# Altium schematic sheet Sheet1.SchDoc
size C
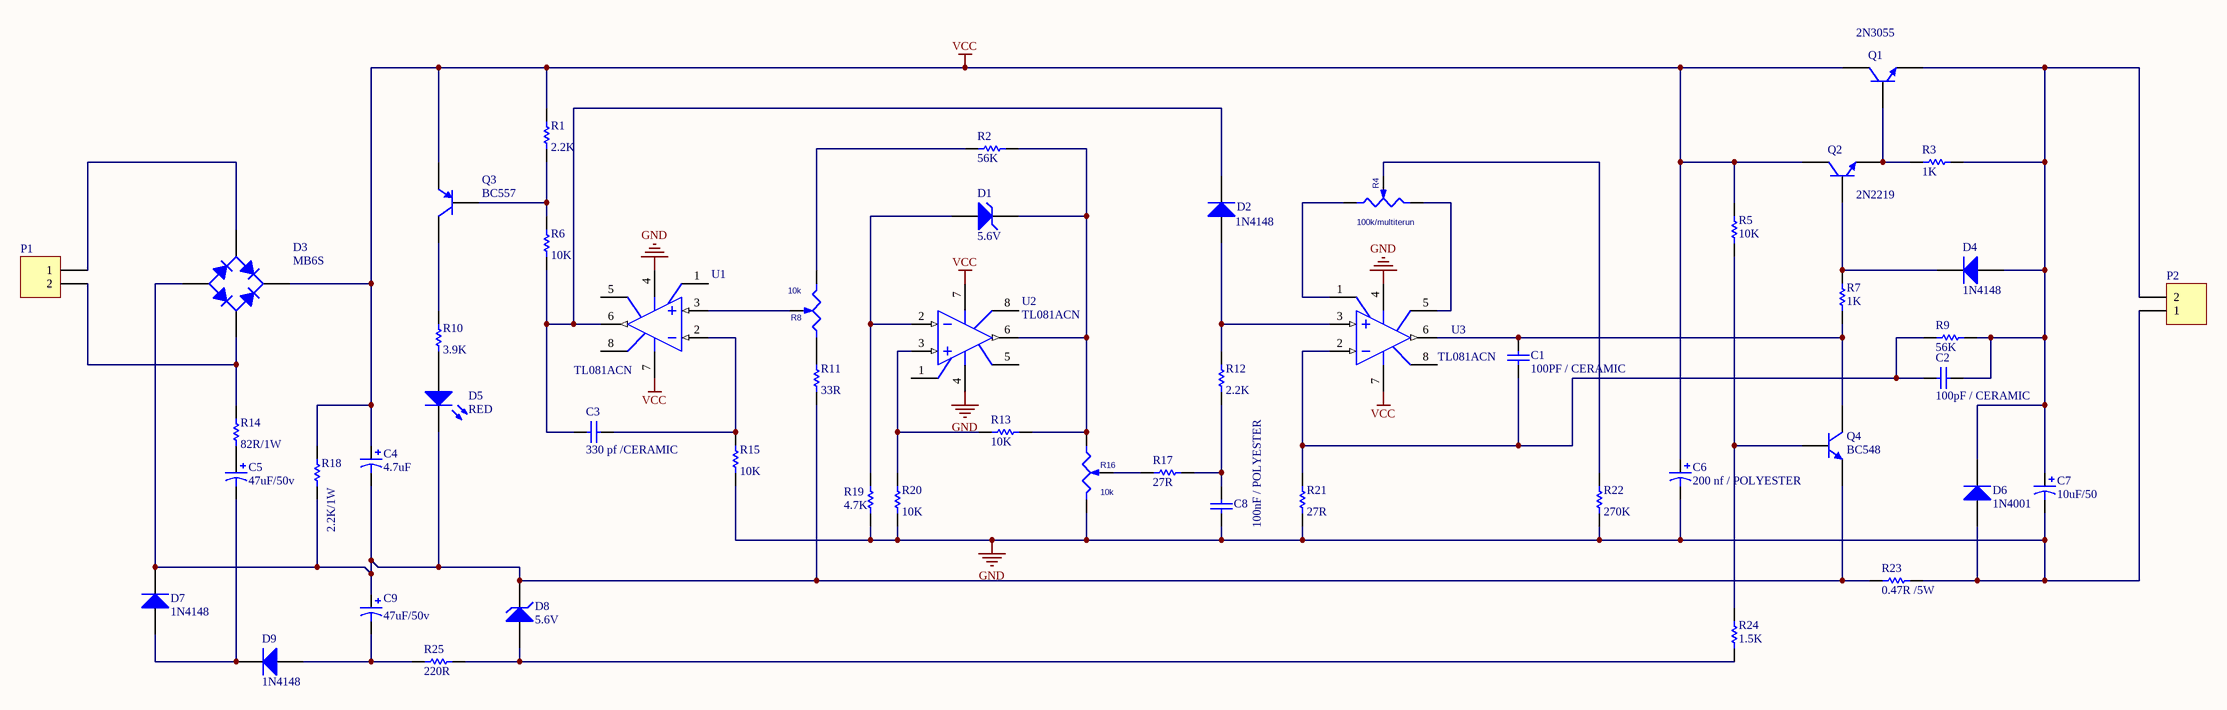
[diagram p0: Sheet1.SchDoc]

## Parts
C1  100PF / CERAMIC  [RAD-0.1_cap]
C2  100pF / CERAMIC  [RAD-0.1_cap]
C3  330 pf /CERAMIC  [RAD-0.1_cap]
C4  4.7uF  [Rad.1/.2-SMALL - duplicate]
C5  47uF/50v  [Rad.1/.2-SMALL - duplicate]
C6  200 nf / POLYESTER  [Rad.1/.2-SMALL - duplicate]
C7  10uF/50  [Rad.1/.2-SMALL - duplicate]
C8  100nF / POLYESTER  [RAD-0.2- duplicate]
C9  47uF/50v  [Rad.1/.2-SMALL - duplicate]
D1  5.6V  [DIODE_ZENER.AXIAL0.3]
D2  1N4148  [Dioad_1n400x_2]
D3  MB6S  [Bridge]
D4  1N4148  [Dioad_1n400x_2]
D5  RED  [Led_3mil - RED]
D6  1N4001  [Dioad_1n400x_2]
D7  1N4148  [Dioad_1n400x_2]
D8  5.6V  [DIODE_ZENER.AXIAL0.3]
D9  1N4148  [Dioad_1n400x_2]
P1  24VDC/3A  [Blue Connector 1*2 -kf301]  (value not drawn)
P2  Blue Connector 1*2 -kf301  [Blue Connector 1*2 -kf301]  (value not drawn)
Q1  2N3055  [Blue Connector 1*3 -kf301]
Q2  2N2219  [TO-92A]
Q3  BC557  [TO-92A]
Q4  BC548  [TO-92A]
R1  2.2K  [AXIAL0.4 - 1k]
R2  56K  [AXIAL0.4 - 1k]
R3  1K  [AXIAL0.4 - 1k]
R4  100k/multiterun  [MULTITERN]
R5  10K  [AXIAL0.4 - 1k]
R6  10K  [AXIAL0.4 - 1k]
R7  1K  [AXIAL0.4 - 1k]
R8  10k  [Blue Connector 1*3 -kf301]
R9  56K  [AXIAL0.4 - 1k]
R10  3.9K  [AXIAL0.4 - 1k]
R11  33R  [AXIAL0.4 - 1k]
R12  2.2K  [AXIAL0.4 - 1k]
R13  10K  [AXIAL0.4 - 1k]
R14  82R/1W  [AXIAL0.4 - 1k]
R15  10K  [AXIAL0.4 - 1k]
R16  10k  [Blue Connector 1*3 -kf301]
R17  27R  [AXIAL0.4 - 1k]
R18  2.2K/1W  [AXIAL0.4 - 1k]
R19  4.7K  [AXIAL0.4 - 1k]
R20  10K  [AXIAL0.4 - 1k]
R21  27R  [AXIAL0.4 - 1k]
R22  270K  [AXIAL0.4 - 1k]
R23  0.47R /5W  [AXIAL0.4 - 1k]
R24  1.5K  [AXIAL0.4 - 1k]
R25  220R  [AXIAL0.4 - 1k]
U1  TL081ACN  [DIP8]
U2  TL081ACN  [DIP8]
U3  TL081ACN  [DIP8]

## Nets
GND: C6.2 C7.2 C8.1 D6.1(A) P2.1 R15.1 R16.1(A) R19.2 R20.1 R21.1 R22.1 R23.1 U1.4(V-) U2.4(V-) U3.4(V-)
VCC: C4.1 C6.1 D3.1(K) Q1.3(C) Q2.3(C) Q3.1(E) R1.2 R5.1 R18.2 U1.7(V+) U2.7(V+) U3.7(V+)
NetC1_1: C1.1 C2.2 R9.1 R21.2 U3.2(IN-)
NetC1_2: C1.2 Q4.3(C) R7.2 U3.6(OUT)
NetC2_1: C2.1 C7.1 D4.1(A) D6.2(K) P2.2 Q1.1(E) R3.2 R9.2
NetC3_1: C3.1 R15.2 U1.2(IN-)
NetC3_2: C3.2 D2.2(K) R6.1 U1.6(OUT)
NetC4_2: C4.2 C9.1 D3.3(A) D5.2(K) D7.2(K) D8.K Q4.1(E) R11.1 R18.1 R23.2
NetC5_1: C5.1 R14.1
NetC5_2: C5.2 D7.1(A) D9.2(K)
NetC8_2: C8.2 R12.1 R17.1
NetC9_2: C9.2 D9.1(A) R25.2
NetD1_A: D1.A R19.1 U2.2(IN-)
NetD1_K: D1.K R2.1 R13.1 R16.3(B) U2.6(OUT)
NetD2_1: D2.1(A) R12.2 U3.3(IN+)
NetD3_2: D3.2(C) P1.2 R14.2
NetD3_4: D3.4(C) P1.1
NetD4_2: D4.2(K) Q2.2(B) R7.1
NetD5_1: D5.1(A) R10.1
NetD8_A: D8.A R24.2 R25.1
NetQ1_2: Q1.2(B) Q2.1(E) R3.1
NetQ3_2: Q3.2(B) R1.1 R6.2
NetQ3_3: Q3.3(C) R10.2
NetQ4_2: Q4.2(B) R5.2 R24.1
NetR2_2: R2.2 R8.1(A)
NetR4_1: R4.1(A) U3.5(OS_NULL)
NetR4_2: R4.2(WIPER) R22.2
NetR4_3: R4.3(B) U3.1(OS_NULL)
NetR8_2: R8.2(WIPER) U1.3(IN+)
NetR8_3: R8.3(B) R11.2
NetR13_2: R13.2 R20.2 U2.3(IN+)
NetR16_2: R16.2(WIPER) R17.2

Not connected (* = marked no-connect by the designer): U1 1(OS_NULL) 5(OS_NULL) 8(NC); U2 1(OS_NULL) 5(OS_NULL) 8(NC); U3 8(NC)

## Library data of the parts
C1-C3 C8 = Cap: Capacitor; Published: 8-Jun-2000; LatestRevisionDate: 17-Jul-2002; LatestRevisionNote: Re-released for DXP Platform.; PackageReference: RAD-0.3; Publisher: Altium Limited; PackageDescription: Radial Cap, Thru-Hole; 2 Leads; 0.3 in Pin Spacing
  C1: Value: 100PF / CERAMIC
  C2: Value: 100pF / CERAMIC
  C3: Value: 330 pf /CERAMIC
  C8: Value: 100nF / POLYESTER
C4-C7 C9 = Cap Pol1: Polarized Capacitor (Radial); Published: 8-Jun-2000; LatestRevisionDate: 17-Jul-2002; LatestRevisionNote: Re-released for DXP Platform.; PackageReference: RB7.6-15; Publisher: Altium Limited; PackageDescription: Polarized Capacitor (Radial); 2 Leads
  C4: Value: 4.7uF
  C5 C9: Value: 47uF/50v
  C6: Value: 200 nf / POLYESTER
  C7: Value: 10uF/50
D1 D8 = D Zener: Zener Diode; Published: 8-Jun-2000; LatestRevisionDate: 17-Jul-2002; LatestRevisionNote: Re-released for DXP Platform.; PackageReference: DIODE-0.7; Publisher: Altium Limited; PackageDescription: Diode, Thru-Hole; 2 Leads; 0.7 in Pin Spacing
D2 D4 D6 D7 D9 = Diode 1N4007: 1 Amp General Purpose Rectifier; Published: 8-Jun-2000; LatestRevisionDate: 17-Jul-2002; LatestRevisionNote: Re-released for DXP Platform.; DatasheetVersion: 1998; PackageVersion: Aug-1999; PackageReference: DO-41; Publisher: Altium Limited; PackageDescription: Diode, Axial; Body 5.2 x 2.7 mm (LxDia. max), Lead Dia. 0.86 mm (max); Code_JEDEC: DO-204-AL; ComponentLink1Description: Manufacturer Link; ComponentLink1URL: http://www.fairchildsemi.com/; ComponentLink2Description: Datasheet; ComponentLink2URL: http://www.fairchildsemi.com/ds/1N%2F1N4001.pdf
D3 = Bridge1: Full Wave Diode Bridge; Published: 8-Jun-2000; LatestRevisionDate: 29-May-2009; LatestRevisionNote: Sch pins A & K swapped.; DatasheetVersion: E2732B; PackageReference: D-38; Publisher: Altium Limited; PackageDescription: Bridge Rectifier; 4 Terminals; Body 9.4 x 9.4 mm (typ); Pitch 5.08 mm
D5 = LED0: Typical INFRARED GaAs LED; Published: 8-Jun-2000; LatestRevisionDate: 08-Jul-2005; LatestRevisionNote: Mech Layer 1 removed.; PackageReference: LED-0; Publisher: Altium Limited; PackageDescription: LED; 2 Leads
P1 = Header 2H: Blue Connector 1*2 -kf301; LatestRevisionDate: 17-Jul-2002; LatestRevisionNote: Re-released for DXP Platform.; Publisher: Altium Limited
P2 = Header 2H: LatestRevisionDate: 17-Jul-2002; LatestRevisionNote: Re-released for DXP Platform.; Publisher: Altium Limited
Q1 Q2 Q4 = 2N3904: NPN General Purpose Amplifier; Published: 8-Jun-2000; LatestRevisionDate: 15-Jan-2003; LatestRevisionNote: PCB Footprint 'BCY-W3/D4.7' replaced; DatasheetVersion: 1997; PackageVersion: Sep-1998; PackageReference: TO-92A; Publisher: Altium Limited; PackageDescription: TO, Flat Index; 3 In-Line, Axial Leads; Body Dia. 4.5mm; Leads 0.51 x 0.48 mm (max); ComponentLink1Description: Manufacturer Link; ComponentLink1URL: http://www.fairchildsemi.com/; ComponentLink2Description: Datasheet; ComponentLink2URL: http://www.fairchildsemi.com/ds/2N%2F2N3904.pdf
Q3 = 2N3906: PNP General Purpose Amplifier; Published: 8-Jun-2000; LatestRevisionDate: 15-Jan-2003; LatestRevisionNote: PCB Footprint 'BCY-W3/D4.7' replaced; DatasheetVersion: 1997; PackageVersion: Sep-1998; PackageReference: TO-92A; Publisher: Altium Limited; PackageDescription: TO, Flat Index; 3 In-Line, Axial Leads; Body Dia. 4.5mm; Leads 0.51 x 0.48 mm (max); ComponentLink1Description: Manufacturer Link; ComponentLink1URL: http://www.fairchildsemi.com/; ComponentLink2Description: Datasheet; ComponentLink2URL: http://www.fairchildsemi.com/ds/2N%2F2N3906.pdf
R1-R3 R5-R7 R9-R15 R17-R25 = Res1: Resistor; Published: 8-Jun-2000; LatestRevisionDate: 17-Jul-2002; LatestRevisionNote: Re-released for DXP Platform.; PackageReference: AXIAL-0.3; Publisher: Altium Limited; PackageDescription: Axial Device, Thru-Hole; 2 Leads; 0.3 in Pin Spacing
  R1 R12: Value: 2.2K
  R2 R9: Value: 56K
  R3 R7: Value: 1K
  R5 R6 R13 R15 R20: Value: 10K
  R10: Value: 3.9K
  R11: Value: 33R
  R14: Value: 82R/1W
  R17 R21: Value: 27R
  R18: Value: 2.2K/1W
  R19: Value: 4.7K
  R22: Value: 270K
  R23: Value: 0.47R /5W
  R24: Value: 1.5K
  R25: Value: 220R
R4 R8 R16 = POT
  R4: Value: 100k/multiterun
  R8 R16: Value: 10k
U1-U3 = TL081ACN: General-Purpose J-FET Single Operational Amplifier; Published: 24-Aug-2001; LatestRevisionDate: 06-Jun-2005; LatestRevisionNote: Stylized 3D Model Added.; DatasheetVersion: Dec-1998; PackageReference: DIP8; Publisher: Altium Limited; PackageDescription: DIP; 8 Leads; Row Spacing 7.62 mm; Pitch 2.54 mm; Code_JEDEC: MO-001-AN; ComponentLink1Description: Manufacturer Link; ComponentLink1URL: http://www.st.com/; ComponentLink2Description: Datasheet; ComponentLink2URL: http://www.st.com/stonline/products/literature/ds/2299/tl081.pdf